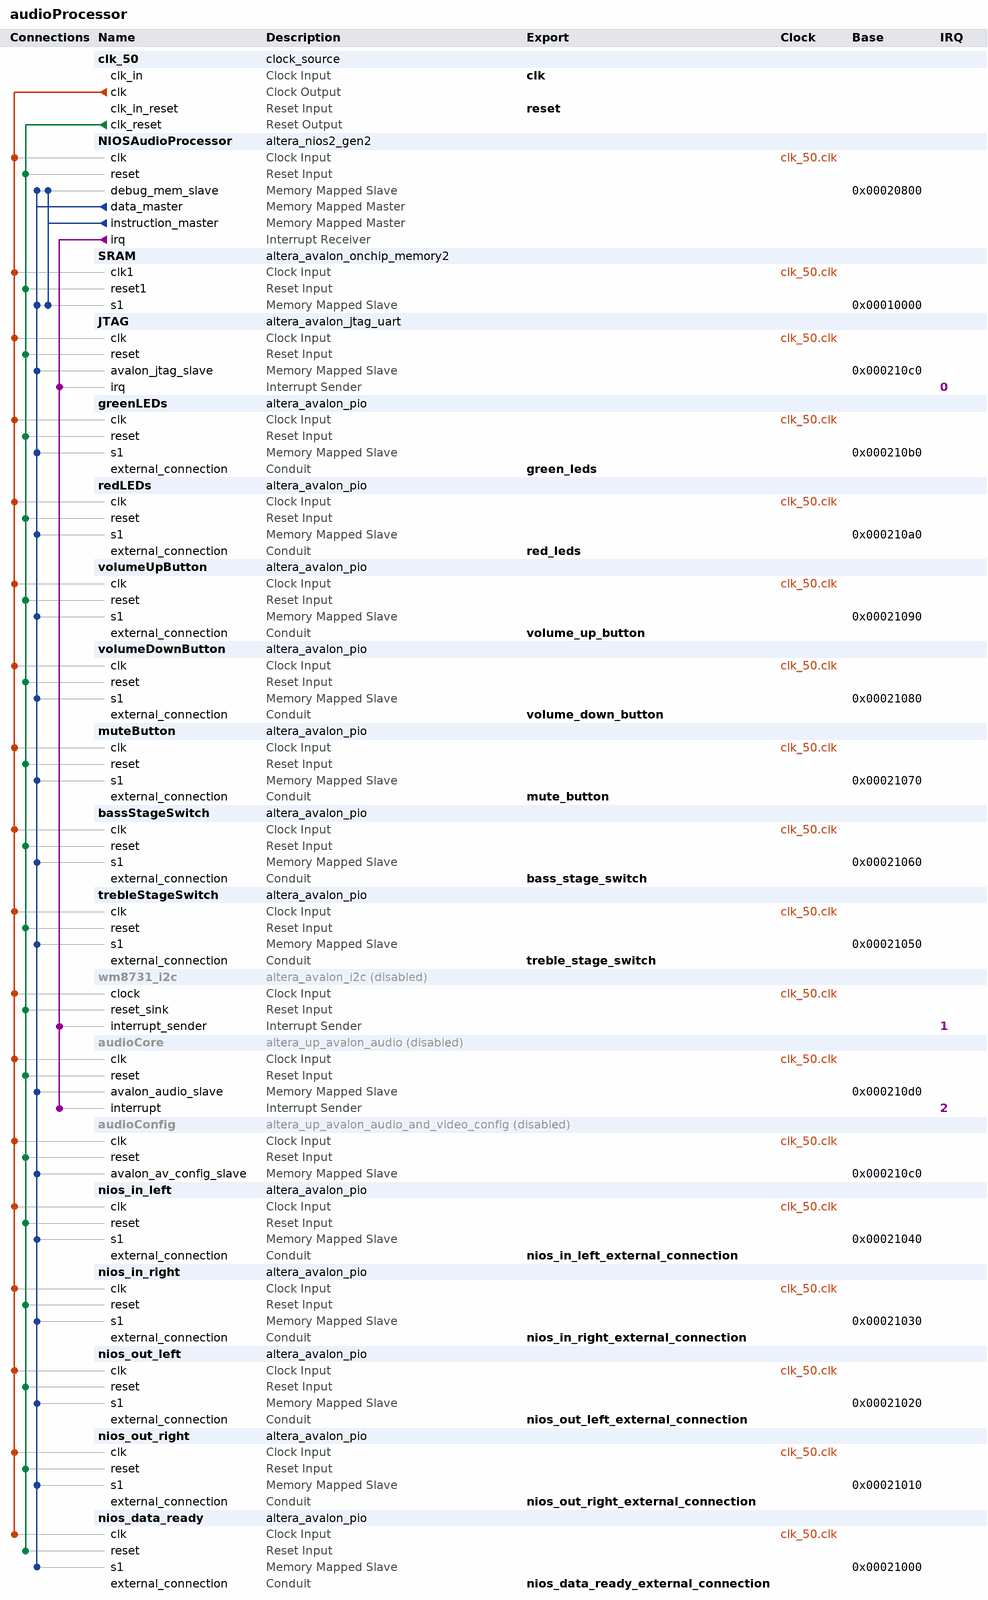
[diagram p0: system contents]
# Platform Designer (Qsys) system audioProcessor, Cyclone IV E EP4CE115F29C7
# Parameters at their usual value, and those the tool derives, are not listed.
package require -exact qsys 18.1
create_system audioProcessor
set_project_property DEVICE_FAMILY {Cyclone IV E}
set_project_property DEVICE EP4CE115F29C7

add_instance clk_50 clock_source 18.1
set_instance_parameter_value clk_50 clockFrequency 50000000

add_instance NIOSAudioProcessor altera_nios2_gen2 18.1
set_instance_parameter_value NIOSAudioProcessor dcache_size 2048
set_instance_parameter_value NIOSAudioProcessor exceptionSlave SRAM.s1
set_instance_parameter_value NIOSAudioProcessor icache_size 4096
set_instance_parameter_value NIOSAudioProcessor impl Tiny
set_instance_parameter_value NIOSAudioProcessor resetSlave SRAM.s1

add_instance SRAM altera_avalon_onchip_memory2 18.1
set_instance_parameter_value SRAM dataWidth 32
set_instance_parameter_value SRAM dualPort false
set_instance_parameter_value SRAM initMemContent true
set_instance_parameter_value SRAM initializationFileName onchip_mem.hex
set_instance_parameter_value SRAM memorySize 40960

add_instance JTAG altera_avalon_jtag_uart 18.1
set_instance_parameter_value JTAG simInteractiveOptions NO_INTERACTIVE_WINDOWS

add_instance greenLEDs altera_avalon_pio 18.1
set_instance_parameter_value greenLEDs direction Output
set_instance_parameter_value greenLEDs width 8

add_instance redLEDs altera_avalon_pio 18.1
set_instance_parameter_value redLEDs direction Output
set_instance_parameter_value redLEDs width 18

add_instance volumeUpButton altera_avalon_pio 18.1
set_instance_parameter_value volumeUpButton direction Input
set_instance_parameter_value volumeUpButton width 1

add_instance volumeDownButton altera_avalon_pio 18.1
set_instance_parameter_value volumeDownButton direction Input
set_instance_parameter_value volumeDownButton width 1

add_instance muteButton altera_avalon_pio 18.1
set_instance_parameter_value muteButton direction Input
set_instance_parameter_value muteButton width 1

add_instance bassStageSwitch altera_avalon_pio 18.1
set_instance_parameter_value bassStageSwitch direction Input
set_instance_parameter_value bassStageSwitch width 2

add_instance trebleStageSwitch altera_avalon_pio 18.1
set_instance_parameter_value trebleStageSwitch direction Input
set_instance_parameter_value trebleStageSwitch width 2

add_instance wm8731_i2c altera_avalon_i2c 18.1
set_instance_property wm8731_i2c ENABLED false
set_instance_parameter_value wm8731_i2c FIFO_DEPTH 4

add_instance audioCore altera_up_avalon_audio 18.0
set_instance_property audioCore ENABLED false
set_instance_parameter_value audioCore audio_in true
set_instance_parameter_value audioCore avalon_bus_type {Memory Mapped}
set_instance_parameter_value audioCore dw 16

add_instance audioConfig altera_up_avalon_audio_and_video_config 18.0
set_instance_property audioConfig ENABLED false
set_instance_parameter_value audioConfig audio_in {Line In to ADC}
set_instance_parameter_value audioConfig bit_length 16
set_instance_parameter_value audioConfig board DE2-115
set_instance_parameter_value audioConfig line_in_bypass false
set_instance_parameter_value audioConfig sampling_rate {48 kHz}

add_instance nios_in_left altera_avalon_pio 18.1
set_instance_parameter_value nios_in_left direction Input
set_instance_parameter_value nios_in_left width 16

add_instance nios_in_right altera_avalon_pio 18.1
set_instance_parameter_value nios_in_right direction Input
set_instance_parameter_value nios_in_right width 16

add_instance nios_out_left altera_avalon_pio 18.1
set_instance_parameter_value nios_out_left direction Output
set_instance_parameter_value nios_out_left width 16

add_instance nios_out_right altera_avalon_pio 18.1
set_instance_parameter_value nios_out_right direction Output
set_instance_parameter_value nios_out_right width 16

add_instance nios_data_ready altera_avalon_pio 18.1
set_instance_parameter_value nios_data_ready direction Input
set_instance_parameter_value nios_data_ready width 1

# connections
add_connection clk_50.clk audioConfig.clk clock
add_connection clk_50.clk audioCore.clk clock
add_connection clk_50.clk bassStageSwitch.clk clock
add_connection clk_50.clk greenLEDs.clk clock
add_connection clk_50.clk JTAG.clk clock
add_connection clk_50.clk muteButton.clk clock
add_connection clk_50.clk nios_data_ready.clk clock
add_connection clk_50.clk nios_in_left.clk clock
add_connection clk_50.clk nios_in_right.clk clock
add_connection clk_50.clk nios_out_left.clk clock
add_connection clk_50.clk nios_out_right.clk clock
add_connection clk_50.clk NIOSAudioProcessor.clk clock
add_connection clk_50.clk redLEDs.clk clock
add_connection clk_50.clk SRAM.clk1 clock
add_connection clk_50.clk trebleStageSwitch.clk clock
add_connection clk_50.clk volumeDownButton.clk clock
add_connection clk_50.clk volumeUpButton.clk clock
add_connection clk_50.clk wm8731_i2c.clock clock
add_connection clk_50.clk_reset audioConfig.reset reset
add_connection clk_50.clk_reset audioCore.reset reset
add_connection clk_50.clk_reset bassStageSwitch.reset reset
add_connection clk_50.clk_reset greenLEDs.reset reset
add_connection clk_50.clk_reset JTAG.reset reset
add_connection clk_50.clk_reset muteButton.reset reset
add_connection clk_50.clk_reset nios_data_ready.reset reset
add_connection clk_50.clk_reset nios_in_left.reset reset
add_connection clk_50.clk_reset nios_in_right.reset reset
add_connection clk_50.clk_reset nios_out_left.reset reset
add_connection clk_50.clk_reset nios_out_right.reset reset
add_connection clk_50.clk_reset NIOSAudioProcessor.reset reset
add_connection clk_50.clk_reset redLEDs.reset reset
add_connection clk_50.clk_reset SRAM.reset1 reset
add_connection clk_50.clk_reset trebleStageSwitch.reset reset
add_connection clk_50.clk_reset volumeDownButton.reset reset
add_connection clk_50.clk_reset volumeUpButton.reset reset
add_connection clk_50.clk_reset wm8731_i2c.reset_sink reset
add_connection NIOSAudioProcessor.data_master audioConfig.avalon_av_config_slave avalon
set_connection_parameter_value NIOSAudioProcessor.data_master/audioConfig.avalon_av_config_slave baseAddress 0x000210c0
add_connection NIOSAudioProcessor.data_master audioCore.avalon_audio_slave avalon
set_connection_parameter_value NIOSAudioProcessor.data_master/audioCore.avalon_audio_slave baseAddress 0x000210d0
add_connection NIOSAudioProcessor.data_master bassStageSwitch.s1 avalon
set_connection_parameter_value NIOSAudioProcessor.data_master/bassStageSwitch.s1 baseAddress 0x00021060
add_connection NIOSAudioProcessor.data_master greenLEDs.s1 avalon
set_connection_parameter_value NIOSAudioProcessor.data_master/greenLEDs.s1 baseAddress 0x000210b0
add_connection NIOSAudioProcessor.data_master JTAG.avalon_jtag_slave avalon
set_connection_parameter_value NIOSAudioProcessor.data_master/JTAG.avalon_jtag_slave baseAddress 0x000210c0
add_connection NIOSAudioProcessor.data_master muteButton.s1 avalon
set_connection_parameter_value NIOSAudioProcessor.data_master/muteButton.s1 baseAddress 0x00021070
add_connection NIOSAudioProcessor.data_master nios_data_ready.s1 avalon
set_connection_parameter_value NIOSAudioProcessor.data_master/nios_data_ready.s1 baseAddress 0x00021000
add_connection NIOSAudioProcessor.data_master nios_in_left.s1 avalon
set_connection_parameter_value NIOSAudioProcessor.data_master/nios_in_left.s1 baseAddress 0x00021040
add_connection NIOSAudioProcessor.data_master nios_in_right.s1 avalon
set_connection_parameter_value NIOSAudioProcessor.data_master/nios_in_right.s1 baseAddress 0x00021030
add_connection NIOSAudioProcessor.data_master nios_out_left.s1 avalon
set_connection_parameter_value NIOSAudioProcessor.data_master/nios_out_left.s1 baseAddress 0x00021020
add_connection NIOSAudioProcessor.data_master nios_out_right.s1 avalon
set_connection_parameter_value NIOSAudioProcessor.data_master/nios_out_right.s1 baseAddress 0x00021010
add_connection NIOSAudioProcessor.data_master NIOSAudioProcessor.debug_mem_slave avalon
set_connection_parameter_value NIOSAudioProcessor.data_master/NIOSAudioProcessor.debug_mem_slave baseAddress 0x00020800
add_connection NIOSAudioProcessor.data_master redLEDs.s1 avalon
set_connection_parameter_value NIOSAudioProcessor.data_master/redLEDs.s1 baseAddress 0x000210a0
add_connection NIOSAudioProcessor.data_master SRAM.s1 avalon
set_connection_parameter_value NIOSAudioProcessor.data_master/SRAM.s1 baseAddress 0x00010000
add_connection NIOSAudioProcessor.data_master trebleStageSwitch.s1 avalon
set_connection_parameter_value NIOSAudioProcessor.data_master/trebleStageSwitch.s1 baseAddress 0x00021050
add_connection NIOSAudioProcessor.data_master volumeDownButton.s1 avalon
set_connection_parameter_value NIOSAudioProcessor.data_master/volumeDownButton.s1 baseAddress 0x00021080
add_connection NIOSAudioProcessor.data_master volumeUpButton.s1 avalon
set_connection_parameter_value NIOSAudioProcessor.data_master/volumeUpButton.s1 baseAddress 0x00021090
add_connection NIOSAudioProcessor.instruction_master NIOSAudioProcessor.debug_mem_slave avalon
set_connection_parameter_value NIOSAudioProcessor.instruction_master/NIOSAudioProcessor.debug_mem_slave baseAddress 0x00020800
add_connection NIOSAudioProcessor.instruction_master SRAM.s1 avalon
set_connection_parameter_value NIOSAudioProcessor.instruction_master/SRAM.s1 baseAddress 0x00010000
add_connection NIOSAudioProcessor.irq audioCore.interrupt interrupt
set_connection_parameter_value NIOSAudioProcessor.irq/audioCore.interrupt irqNumber 2
add_connection NIOSAudioProcessor.irq JTAG.irq interrupt
set_connection_parameter_value NIOSAudioProcessor.irq/JTAG.irq irqNumber 0
add_connection NIOSAudioProcessor.irq wm8731_i2c.interrupt_sender interrupt
set_connection_parameter_value NIOSAudioProcessor.irq/wm8731_i2c.interrupt_sender irqNumber 1

# exported interfaces
add_interface bass_stage_switch conduit end
set_interface_property bass_stage_switch EXPORT_OF bassStageSwitch.external_connection
add_interface clk clock sink
set_interface_property clk EXPORT_OF clk_50.clk_in
add_interface green_leds conduit end
set_interface_property green_leds EXPORT_OF greenLEDs.external_connection
add_interface mute_button conduit end
set_interface_property mute_button EXPORT_OF muteButton.external_connection
add_interface nios_data_ready_external_connection conduit end
set_interface_property nios_data_ready_external_connection EXPORT_OF nios_data_ready.external_connection
add_interface nios_in_left_external_connection conduit end
set_interface_property nios_in_left_external_connection EXPORT_OF nios_in_left.external_connection
add_interface nios_in_right_external_connection conduit end
set_interface_property nios_in_right_external_connection EXPORT_OF nios_in_right.external_connection
add_interface nios_out_left_external_connection conduit end
set_interface_property nios_out_left_external_connection EXPORT_OF nios_out_left.external_connection
add_interface nios_out_right_external_connection conduit end
set_interface_property nios_out_right_external_connection EXPORT_OF nios_out_right.external_connection
add_interface red_leds conduit end
set_interface_property red_leds EXPORT_OF redLEDs.external_connection
add_interface reset reset sink
set_interface_property reset EXPORT_OF clk_50.clk_in_reset
add_interface treble_stage_switch conduit end
set_interface_property treble_stage_switch EXPORT_OF trebleStageSwitch.external_connection
add_interface volume_down_button conduit end
set_interface_property volume_down_button EXPORT_OF volumeDownButton.external_connection
add_interface volume_up_button conduit end
set_interface_property volume_up_button EXPORT_OF volumeUpButton.external_connection

set_interconnect_requirement {$system} qsys_mm.clockCrossingAdapter HANDSHAKE
set_interconnect_requirement {$system} qsys_mm.enableEccProtection FALSE
set_interconnect_requirement {$system} qsys_mm.insertDefaultSlave FALSE
set_interconnect_requirement {$system} qsys_mm.maxAdditionalLatency 1

save_system audioProcessor.qsys
